# EAGLE schematic untitled (EAGLE 9.6.1)
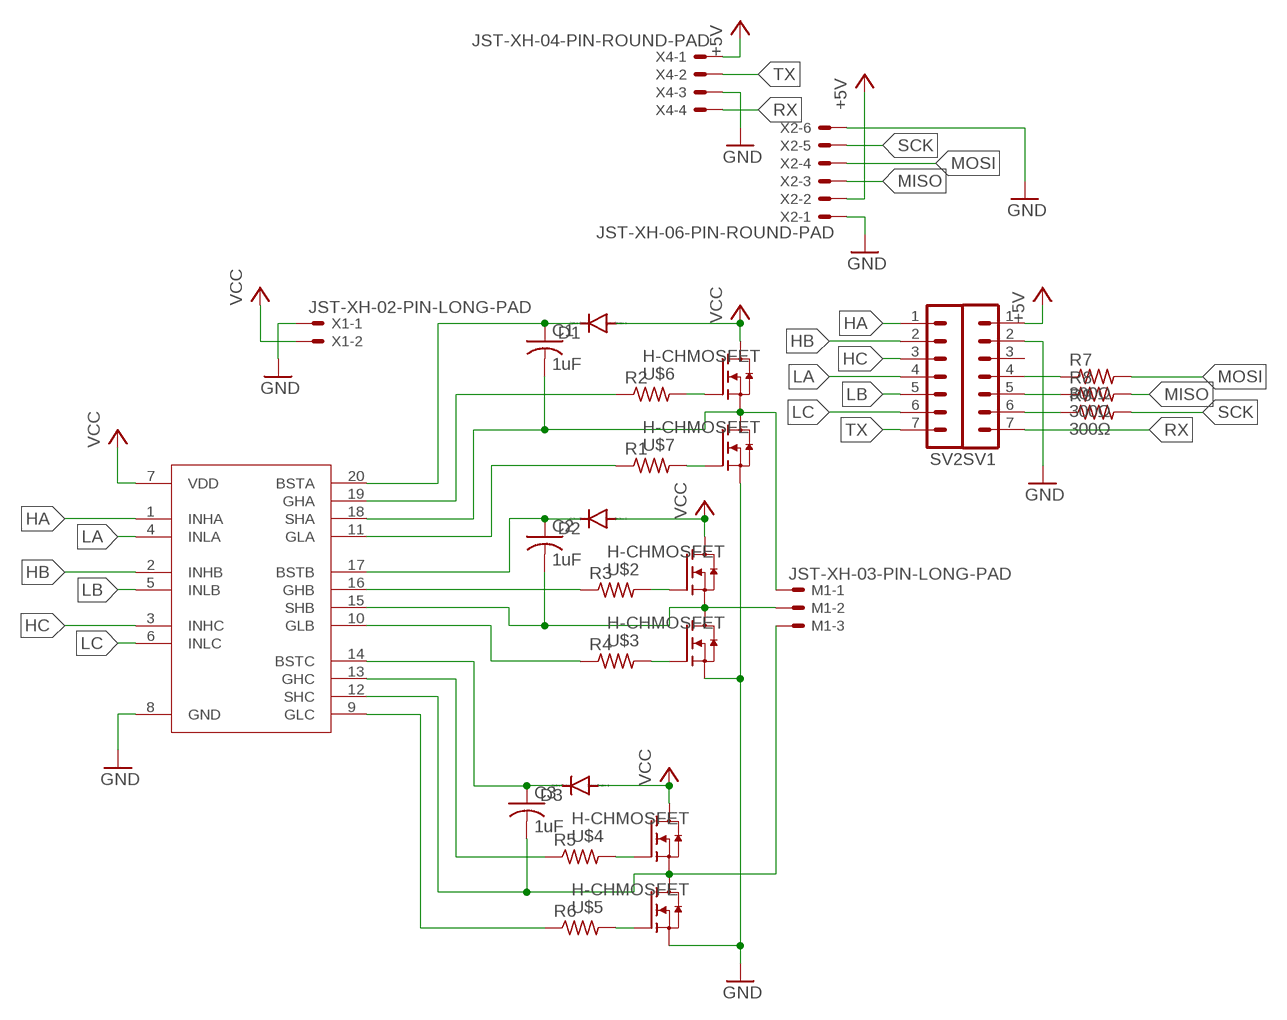
[diagram p0: schematic, sheet 1]

## Parts
C1  1uF  C-USC2012  [C2012]
C2  1uF  C-USC2012  [C2012]
C3  1uF  C-USC2012  [C2012]
D1  DIODE-DO-214AC  [DO-214AC]
D2  DIODE-DO-214AC  [DO-214AC]
D3  DIODE-DO-214AC  [DO-214AC]
M1  JST-XH-03-PIN-LONG-PAD  [JST-XH-03-PACKAGE-LONG-PAD]
R1  R-US_M2012  [M2012]
R2  R-US_M2012  [M2012]
R3  R-US_M2012  [M2012]
R4  R-US_M2012  [M2012]
R5  R-US_M2012  [M2012]
R6  R-US_M2012  [M2012]
R7  300Ω  R-US_M2012  [M2012]
R8  300Ω  R-US_M2012  [M2012]
R9  300Ω  R-US_M2012  [M2012]
SV1  MA07-1  [MA07-1]
SV2  MA07-1  [MA07-1]
U$1  DRV8300NIPWR  [SOIC65P640X120-20N]
U$2  H-CHMOSFET  [DPAK228P990X238-4N]
U$3  H-CHMOSFET  [DPAK228P990X238-4N]
U$4  H-CHMOSFET  [DPAK228P990X238-4N]
U$5  H-CHMOSFET  [DPAK228P990X238-4N]
U$6  H-CHMOSFET  [DPAK228P990X238-4N]
U$7  H-CHMOSFET  [DPAK228P990X238-4N]
X1  JST-XH-02-PIN-LONG-PAD  [JST-XH-02-PACKAGE-LONG-PAD]
X2  JST-XH-06-PIN-ROUND-PAD  [JST-XH-06-PACKAGE-ROUND-PAD]
X4  JST-XH-04-PIN-ROUND-PAD  [JST-XH-04-PACKAGE-ROUND-PAD]

## Nets
+5V: SV1.1 X2.2 X4.1
GND: SV1.2 U$1.8(GND) U$3.3(S) U$5.3(S) U$7.3(S) X1.1 X2.1 X2.6 X4.3
HA: SV2.1 U$1.1(INHA)
HB: SV2.2 U$1.2(INHB)
HC: SV2.3 U$1.3(INHC)
LA: SV2.4 U$1.4(INLA)
LB: SV2.5 U$1.5(INLB)
LC: SV2.6 U$1.6(INLC)
MISO: R8.2 X2.3
MOSI: R7.2 X2.4
N$1: C2.2 M1.2 U$1.15(SHB) U$2.3(S) U$3.4(D)
N$2: C3.2 M1.3 U$1.12(SHC) U$4.3(S) U$5.4(D)
N$3: C1.2 M1.1 U$1.18(SHA) U$6.3(S) U$7.4(D)
N$4: R2.2 U$6.1(G)
N$5: R1.2 U$7.1(G)
N$6: R2.1 U$1.19(GHA)
N$7: R1.1 U$1.11(GLA)
N$8: R3.2 U$2.1(G)
N$9: C1.1 D1.C U$1.20(BSTA)
N$10: R4.2 U$3.1(G)
N$11: R7.1 SV1.4
N$12: R3.1 U$1.16(GHB)
N$13: C2.1 D2.C U$1.17(BSTB)
N$14: R4.1 U$1.10(GLB)
N$15: R6.2 U$5.1(G)
N$16: R5.2 U$4.1(G)
N$17: R5.1 U$1.13(GHC)
N$18: R6.1 U$1.9(GLC)
N$19: C3.1 D3.C U$1.14(BSTC)
N$20: R9.1 SV1.6
N$21: R8.1 SV1.5
RX: SV1.7 X4.4
SCK: R9.2 X2.5
TX: SV2.7 X4.2
VCC: D1.A D2.A D3.A U$1.7(VDD) U$2.4(D) U$4.4(D) U$6.4(D) X1.2
Unconnected: SV1.3

## Library data of the parts
C1-C3 = adafruit:C-US: CAPACITOR, American symbol
D1-D3 = diode:DIODE-: DIODE
M1 = Rembrandt Electronics - JST XH Connectors v1-0:JST-XH-03-PIN: JST XH Connector 2 Pin Wire to board connector. Pitch: 2,54 mm, (0.100") Number of pins: 3 Created by Rembrandt Electronics www.rembrandtelectronics.com
R1-R9 = adafruit:R-US_: RESISTOR, American symbol
SV1 SV2 = con-lstb:MA07-1: PIN HEADER; OC_FARNELL: unknown; OC_NEWARK: unknown
U$1 = drv8300:DRV8300NIPWR
U$2-U$7 = N-ch mosfet:H-CHMOSFET
X1 = Rembrandt Electronics - JST XH Connectors v1-0:JST-XH-02-PIN: JST XH Connector 2 Pin Wire to board connector. Pitch: 2,54 mm, (0.100") Number of pins: 2 Created by Rembrandt Electronics www.rembrandtelectronics.com
X2 = Rembrandt Electronics - JST XH Connectors v1-0:JST-XH-06-PIN: JST XH Connector 2 Pin Wire to board connector. Pitch: 2,54 mm, (0.100") Number of pins: 6 Created by Rembrandt Electronics www.rembrandtelectronics.com
X4 = Rembrandt Electronics - JST XH Connectors v1-0:JST-XH-04-PIN: JST XH Connector 2 Pin Wire to board connector. Pitch: 2,54 mm, (0.100") Number of pins: 4 Created by Rembrandt Electronics www.rembrandtelectronics.com